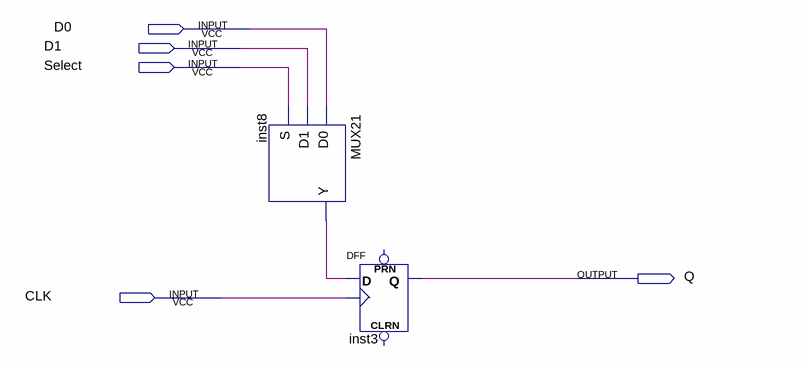
[diagram p0: schematic sheet]
// Quartus schematic Shift_right_sysbol.bdf as structural Verilog: 2 symbols, 5 pins
module Shift_right_sysbol (
  input  D0,
  input  D1,
  input  Select,
  input  CLK,
  output Q
);

  wire inst8_y;

  MUX21 inst8 (.D0(D0), .D1(D1), .S(Select), .Y(inst8_y));
  DFF inst3 (.CLK(CLK), .D(inst8_y), .Q(Q));  // open: CLRN, PRN
endmodule
